# Altium schematic sheet stm32h750ibk6-pwr.SchDoc: MCUA
size A4; Date: 10.02.2025; CheckedBy: BCY; DrawnBy: miaow; Revision: V0.0.1; SheetNumber: 6; SheetTotal: 7; Sample: A0; Url: github.com/miaow-cn/pcb-lib; Liscense: GPLv3; Board: MIAOW FOC BOARD; BoardType: MAIN_PCB; Desc: power part of stm32h750
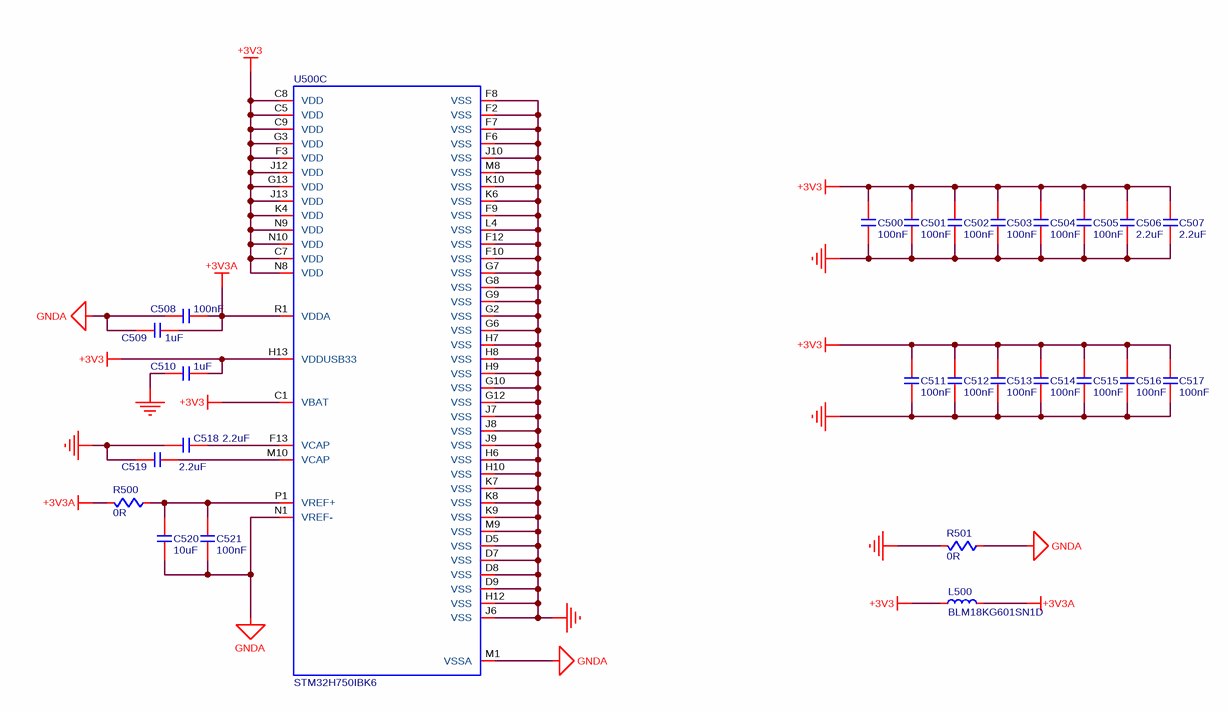
[diagram p0: stm32h750ibk6-pwr.SchDoc]

## Parts
C500  value 100nF  [C0402]  (hidden comment: C-NOMO)
C501  value 100nF  [C0402]  (hidden comment: C-NOMO)
C502  value 100nF  [C0402]  (hidden comment: C-NOMO)
C503  value 100nF  [C0402]  (hidden comment: C-NOMO)
C504  value 100nF  [C0402]  (hidden comment: C-NOMO)
C505  value 100nF  [C0402]  (hidden comment: C-NOMO)
C506  value 2.2uF  [C0603]  (hidden comment: C-NOMO)
C507  value 2.2uF  [C0603]  (hidden comment: C-NOMO)
C508  value 1uF  [C0603]  (hidden comment: C-NOMO)
C509  value 100nF  [C0402]  (hidden comment: C-NOMO)
C510  value 1uF  [C0603]  (hidden comment: C-NOMO)
C511  value 100nF  [C0402]  (hidden comment: C-NOMO)
C512  value 100nF  [C0402]  (hidden comment: C-NOMO)
C513  value 100nF  [C0402]  (hidden comment: C-NOMO)
C514  value 100nF  [C0402]  (hidden comment: C-NOMO)
C515  value 100nF  [C0402]  (hidden comment: C-NOMO)
C516  value 100nF  [C0402]  (hidden comment: C-NOMO)
C517  value 100nF  [C0402]  (hidden comment: C-NOMO)
C518  value 2.2uF  [C0603]  (hidden comment: C-NOMO)
C519  value 2.2uF  [C0603]  (hidden comment: C-NOMO)
C520  value 10uF  [C0603]  (hidden comment: C-NOMO)
C521  value 100nF  [C0402]  (hidden comment: C-NOMO)
L500  BLM18KG601SN1D  [L0603]
R500  value 0R  [R0603]  (hidden comment: R)
R501  value 0R  [R0603]  (hidden comment: R)
U500  STM32H750IBK6  [STM32H750IBK6]  (part C of 3)

## Nets
+3V3: C500.2 C501.2 C502.2 C503.2 C504.2 C505.2 C506.2 C507.2 C510.1 C511.2 C512.2 C513.2 C514.2 C515.2 C516.2 C517.2 L500.1 U500.C1(VBAT) U500.C5(VDD) U500.C7(VDD) U500.C8(VDD) U500.C9(VDD) U500.F3(VDD) U500.G3(VDD) U500.G13(VDD) U500.H13(VDDUSB33) U500.J12(VDD) U500.J13(VDD) U500.K4(VDD) U500.N8(VDD) U500.N9(VDD) U500.N10(VDD)
+3V3A: C508.1 C509.1 L500.2 R500.1 U500.R1(VDDA)
GND: C500.1 C501.1 C502.1 C503.1 C504.1 C505.1 C506.1 C507.1 C510.2 C511.1 C512.1 C513.1 C514.1 C515.1 C516.1 C517.1 C518.1 C519.1 R501.1 U500.D5(VSS) U500.D7(VSS) U500.D8(VSS) U500.D9(VSS) U500.F2(VSS) U500.F6(VSS) U500.F7(VSS) U500.F8(VSS) U500.F9(VSS) U500.F10(VSS) U500.F12(VSS) U500.G2(VSS) U500.G6(VSS) U500.G7(VSS) U500.G8(VSS) U500.G9(VSS) U500.G10(VSS) U500.G12(VSS) U500.H6(VSS) U500.H7(VSS) U500.H8(VSS) U500.H9(VSS) U500.H10(VSS) U500.H12(VSS) U500.J6(VSS) U500.J7(VSS) U500.J8(VSS) U500.J9(VSS) U500.J10(VSS) U500.K6(VSS) U500.K7(VSS) U500.K8(VSS) U500.K9(VSS) U500.K10(VSS) U500.L4(VSS) U500.M8(VSS) U500.M9(VSS)
GNDA: C508.2 C509.2 C520.1 C521.1 R501.2 U500.M1(VSSA) U500.N1(VREF-)
NetC518_2: C518.2 U500.F13(VCAP)
NetC519_2: C519.2 U500.M10(VCAP)
NetC520_2: C520.2 C521.2 R500.2 U500.P1(VREF+)

## Notes on the sheet
- DRAWN
- CHECKED
- DRAWNBY
- SHEETS
- SHEETS_NO

## Library data of the parts
C500-C521 = C-NOMO: voltage: 25V; precision: 5%
L500 = L: Code_IEC: 1005; Value: 600Ω@100MHz; Published: 8-Jun-2000; LatestRevisionDate: 29-May-2009; LatestRevisionNote: IPC-7351 Footprint Added.; PackageReference: 0402-A; Publisher: Altium Limited; PackageDescription: Chip Inductor; Code_JEITA: 0402
R500 R501 = R: precision: 1%
U500 = STM32H750IBK6: Supplier 1: LCSC; Supplier Part Number 1: C730200; ClassName: BGA